# Altium project Reconfigurable_Test_Fixture.PrjPcb
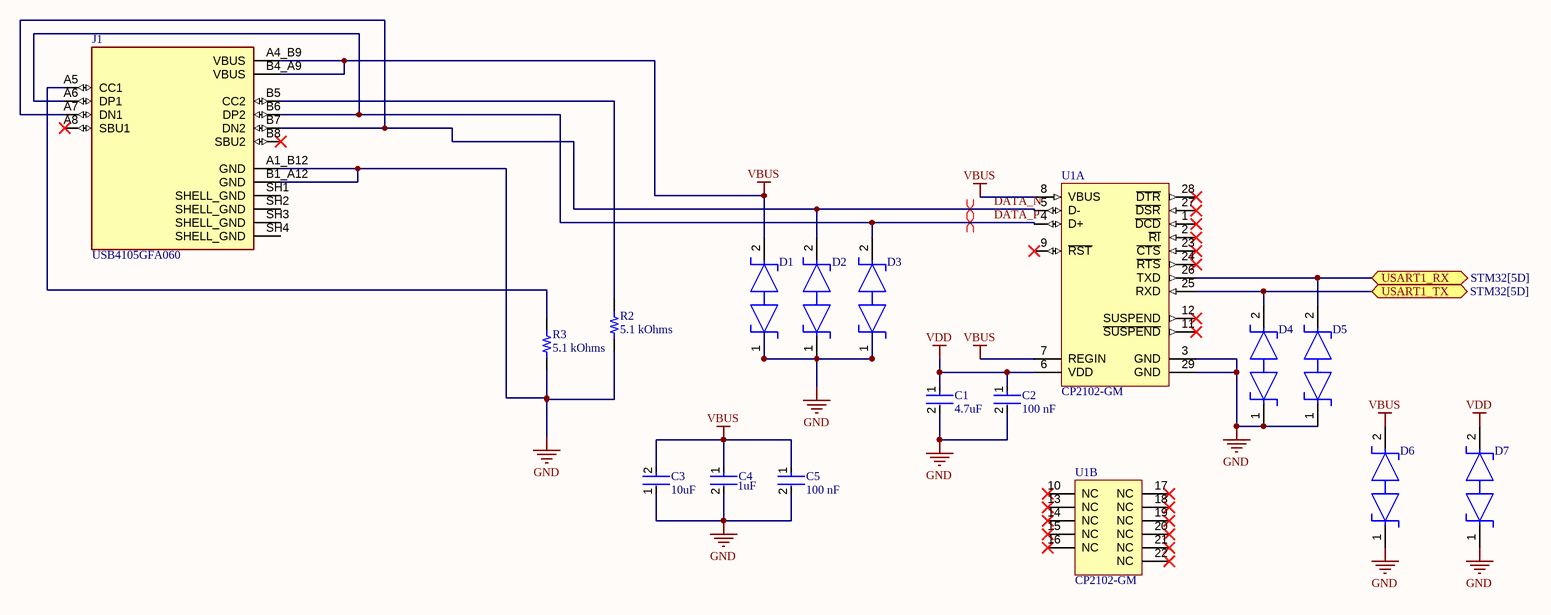
[diagram p0: USB_to_UART.SchDoc]
4 sheets, 80 parts. Net scope: flat (ports and power ports of the same name join across sheets).
Sheets:
  USB_to_UART.SchDoc
  STM32.SchDoc
  Analog_Switch_Array_and_ZIF_ socket.SchDoc
  Muxes_and_ADC.SchDoc

## Sheet USB_to_UART.SchDoc
size 431 x 279 mm; Organization: ORGANIZATION; Address1: ADDRESS 1; Address2: ADDRESS 2; Address3: ADDRESS 3; Address4: ADDRESS 4; Revision: -; SheetNumber: 1; SheetTotal: 4; ENG_APP_DATE: --/--/--; DSN_APP_DATE: --/--/--; CHK_APP_DATE: --/--/--

### Parts
C1  4.7uF  [FP-C1005-050-0_15-IPC_C]
C2  100 nF  [FP-CC0402-MFG]
C3  10uF  [FP-C1608-080-0_1-MFG]
C4  1uF  [FP-C0402C105K8PACTU-MFG]
C5  100 nF  [FP-CC0402-MFG]
D1  TPD1E10B06DPYR  [FP-DPY0002A-MFG]  (value not drawn)
D2  TPD1E10B06DPYR  [FP-DPY0002A-MFG]  (value not drawn)
D3  TPD1E10B06DPYR  [FP-DPY0002A-MFG]  (value not drawn)
D4  TPD1E10B06DPYR  [FP-DPY0002A-MFG]  (value not drawn)
D5  TPD1E10B06DPYR  [FP-DPY0002A-MFG]  (value not drawn)
D6  TPD1E10B06DPYR  [FP-DPY0002A-MFG]  (value not drawn)
D7  TPD1E10B06DPYR  [FP-DPY0002A-MFG]  (value not drawn)
J1  USB4105GFA060  [GCT_USB4105GFA060]
R2  value 5.1 kOhms  [YAGEO RES 0603_1608]  (hidden comment: RC0603JR-105K1L)
R3  value 5.1 kOhms  [YAGEO RES 0603_1608]  (hidden comment: RC0603JR-105K1L)
U1  CP2102-GM  [SLAB-QFN-28-3125x3125TP_N]  (parts A,B of 2)

### Ports
USART1_RX (bidir, see STM32[5D]), USART1_TX (bidir, see STM32[5D])

### Nets
GND: C1.2 C2.2 C3.1 C4.2 C5.2 D1.1 D2.1 D3.1 D4.1 D5.1 D6.1 D7.1 J1.A1_B12(GND) J1.B1_A12(GND) R2.1 R3.1 U1.3(GND) U1.29(GND)
VBUS: C3.2 C4.1 C5.1 D1.2 D6.2 J1.A4_B9(VBUS) J1.B4_A9(VBUS) U1.7(REGIN) U1.8(VBUS)
VDD: C1.1 C2.1 D7.2 U1.6(VDD)
DATA_N: D2.2 J1.A7(DN1) J1.B7(DN2) U1.5(D-)
DATA_P: D3.2 J1.A6(DP1) J1.B6(DP2) U1.4(D+)
NetD4_2: D4.2 U1.25(RXD) ; port USART1_TX
NetD5_2: D5.2 U1.26(TXD) ; port USART1_RX
NetJ1_A5: J1.A5(CC1) R3.2
NetJ1_B5: J1.B5(CC2) R2.2

Not connected (* = marked no-connect by the designer): J1 A8(SBU1)* B8(SBU2)* SH1(SHELL_GND) SH2(SHELL_GND) SH3(SHELL_GND) SH4(SHELL_GND); U1 1(~{DCD})* 2(~{RI})* 9(~{RST})* 10(NC)* 11(~{SUSPEND})* 12(SUSPEND)* 13(NC)* 14(NC)* 15(NC)* 16(NC)* 17(NC)* 18(NC)* 19(NC)* 20(NC)* 21(NC)* 22(NC)* 23(~{CTS})* 24(~{RTS})* 27(~{DSR})* 28(~{DTR})*

### Layout directives
differential pair: DATA_N, DATA_P

### Notes on the sheet
- DWG. NO.
- REV.
- SHT.
- THIS DOCUMENT AND THE DATA DISCLOSED HEREIN OR HEREWITH IS THE PROPERTY OF ALTIUM LIMITED AND MAY BE FREELY DISTRIBUTED IN WHOLE. NO RIGHTS ARE RESERVED OR EXPRESS OR IMPLIED WARANTEE GIVEN.
- REVISION
- DESCRIPTION
- DATE
- APPROVED
- ENG:
- APPROVALS
- PROJECT
- DSN:
- CHK:
- REFERENCE DOCUMENTS
- PROJECT REVISION:
- TITLE
- DOCUMENT REVISION:
- DESIGN ITEM:
- BOM:
- FAB DWG:
- PCB DWG:
- ASSY DWG:
- SCALE:
- SIZE
- B
- CAGE CODE
- FILE NAME
- DWG NO.
- SHEET
- OF
- REV

### Library data of the parts
C1 = CMP-2000-05997-2: CAP CER 4.7UF 10V X5R 0402; Manufacturer: TDK; PartNumber: C1005X5R1A475K050BC; Dielectric Material: Ceramic; Tolerance: 10%; Series: C; Package Quantity: 10000; Max Operating Temperature: 85°C; Case Code (Imperial): 0402; Lead Free: Lead Free; Voltage Rating (DC): 10V; Packaging: Cut Tape; Voltage Rating: 10V; Min Operating Temperature: -55°C; Dielectric: X5R; Thickness: 0.022inch; Width: 0.02inch; Case/Package: 0402; Case Code (Metric): 1005; Capacitance: 4.7uF; Length: 0.039inch; RoHS Compliant: Yes; REACH SVHC: No SVHC; Mount: Surface Mount
C2 C5 = CMP-03422-000048-1: CAP CER 0.1UF 16V X7R 0402; Manufacturer: YAGEO; PartNumber: CC0402KRX7R7BB104; Material: Ceramic; Automotive Grade: NA; Temperature Coefficient: 30ppm/°C; Tolerance: 0.1; Device Class L1: Passive Components; Temperature Range Low: -55°C; Device Class L3: Ceramic Capacitors; Temperature Characteristic: X7R; Ipc Land Pattern Name: CAPC10050X50; Capacitance: 100 nF; Temperature Range High: +125°C; Voltage Rating: 16 V; Temperature: -55°C to +125°C; RoHS: TRUE; Automotive: No; Height: 0.55mm; Device Class L2: Capacitors; Digikey Description: CAP CER 0.1UF 16V X7R 0402; Package: CC0402; Footprint Url: http://www.yageo.com/exep/pages/download/literatures/UPY-C_GEN_24.pdf; ComponentLink2Description: Datasheet; Category: Cap; Lead Free: Yes; Value: 100 nF; Octopart: https://octopart.com/cc0402krx7r7bb104-yageo-42244624; ComponentLink2URL: http://www.yageo.com/documents/recent/UPY-GP_NP0_16V-to-50V_16.pdf; Mouser Description: 0402 0.1 uF 16 V ±10 % Tolerance X7R SMT Multilayer Ceramic Capacitor
C3 = CMP-2000-04979-3: Multilayer Ceramic Capacitors 10μF ±10% 10V X5R SMD 0603; PartNumber: C1608X5R1A106K080AC; Manufacturer: TDK; Dielectric Material: Ceramic; Construction: Flat; Height: 0.8mm; Thickness: 0.035inch; Case Code (Metric): 1608; Radiation Hardening: No; Number of Pins: 2; Voltage Rating (DC): 10V; Depth: 0.8mm; Voltage: 10V; RoHS Compliant: Yes; Voltage Rating: 10V; Package Quantity: 1; Resistor Type: Ceramic; Termination: SMD/SMT; Lead Free: Lead Free; REACH SVHC: No SVHC; Tolerance: 10%; Mount: Surface Mount; Series: C; Packaging: Tape and Reel; Width: 0.8mm; Dielectric: X5R; Weight: 7.1E-05oz; Length: 1.6mm; Max Operating Temperature: 85°C; Case Code (Imperial): 0603; Case/Package: 0603; Min Operating Temperature: -55°C; Capacitance: 10uF
C4 = CMP-2008-02081-2: CAP CER 1UF 10V X5R 0402; Manufacturer: KEMET; PartNumber: C0402C105K8PACTU; Dielectric Material: Ceramic; Dissipation Factor: 5%; Tolerance: 10%; Number of Pins: 2; Contact Plating: Tin; Min Operating Temperature: -55°C; Termination: SMD/SMT; Lead Free: Lead Free; Construction: Flat; Voltage Rating (DC): 10V; Mount: Surface Mount; Series: C; Thickness: 0.022inch; Width: 0.5mm; Radiation Hardening: No; Capacitance: 1uF; Dielectric: X5R; Height: 0.5mm; Voltage: 10V; Length: 1mm; Depth: 0.5mm; Max Operating Temperature: 85°C; Package Quantity: 1; Packaging: Tape and Reel; RoHS Compliant: Yes; Case Code (Imperial): 0402; Case Code (Metric): 1005; REACH SVHC: No SVHC; Voltage Rating: 10V; Case/Package: 0402
D1-D7 = CMP-0326-00004-4: TVS DIODE 5.5V 14V 2X1SON; Manufacturer: Texas Instruments; Leakage Current: 100nA; Min Breakdown Voltage: 6V; Number of Channels: 1; ESD Protection: Yes; Power Line Protection: No; Test Current: 1mA; Interface: GPIO; Element Configuration: Single; Peak Pulse Current: 5A; Direction: Bidirectional; Peak Pulse Power: 90W; Capacitance: 12pF; Composition: Zener; Packaging: Tape and Reel; Number of Pins: 2; Breakdown Voltage: 6V; Radiation Hardening: No; Min Operating Temperature: -40°C; Contact Plating: Gold; Lead Free: Lead Free; Height: 0.35mm; REACH SVHC: No SVHC; Case/Package: 0402; Max Operating Temperature: 125°C; Width: 0.7mm; Clamping Voltage: 14V; Package Quantity: 1; Max Reverse Leakage Current: 100nA; Working Voltage: 5.5V; Length: 1.1mm; Number of Bidirectional Channels: 1; Reverse Standoff Voltage: 5.5V; PartNumber: TPD1E10B06DPYR
J1 = CMP-002-00267-1: USB-C (USB TYPE-C) USB 2.0 Receptacle Connector 24 (16+8 Dummy) Position Surface Mount, Right Angle; Through Hole; MF: Global Connector Technology; Check_prices: https://www.snapeda.com/parts/USB4105GFA060/Global+Connector+Technology/view-part/?ref=eda; Component Type: Standard; Source: USB4105GFA060.SchLib; SnapEDA_Link: https://www.snapeda.com/parts/USB4105GFA060/Global+Connector+Technology/view-part/?ref=snap; Pins: 16; Case/Package: None; Design Item ID: USB4105GFA060; Value: *; MP: USB4105GFA060
R2 R3 = CMP-009-046115-1: RES 5.1K OHM 5% 1/10W 0603; Part Number: RC0603JR-105K1L
U1 = CMP-0511-00012-1: Single-Chip USB to UART Bridge, 1024 Bytes EEPROM, -40 to 85 degC, 28-pin QFN, Tube; Manufacturer: Silicon Labs; Internal Oscillator: TRUE; Sub-Family: USB Bridges; ComponentLink3Description: Package Specification; PackageDescription: 28-Pin Quad-Flat No-Leads Package, Body 5 x 5 mm, Pitch 0.5 mm; PartNumber: CP2102-GM; EEPROM: 1024 Bytes; Mounting Technology: Surface Mount; ComponentLink2URL: http://www.silabs.com/Support%20Documents/TechnicalDocs/CP2102-9.pdf; DatasheetVersion: Rev. 1.5; ComponentLink1URL: http://www.silabs.com/; ComponentLink2Description: Datasheet; Code_JEDEC: MO-220; PackageReference: QFN-28; Code_IPC: J-STD-020C; ComponentLink3URL: http://www.silabs.com/Support%20Documents/TechnicalDocs/C8051T61x.pdf; ComponentLink1Description: Manufacturer URL

## Sheet STM32.SchDoc
size 431 x 279 mm; SheetNumber: 2; SheetTotal: 4
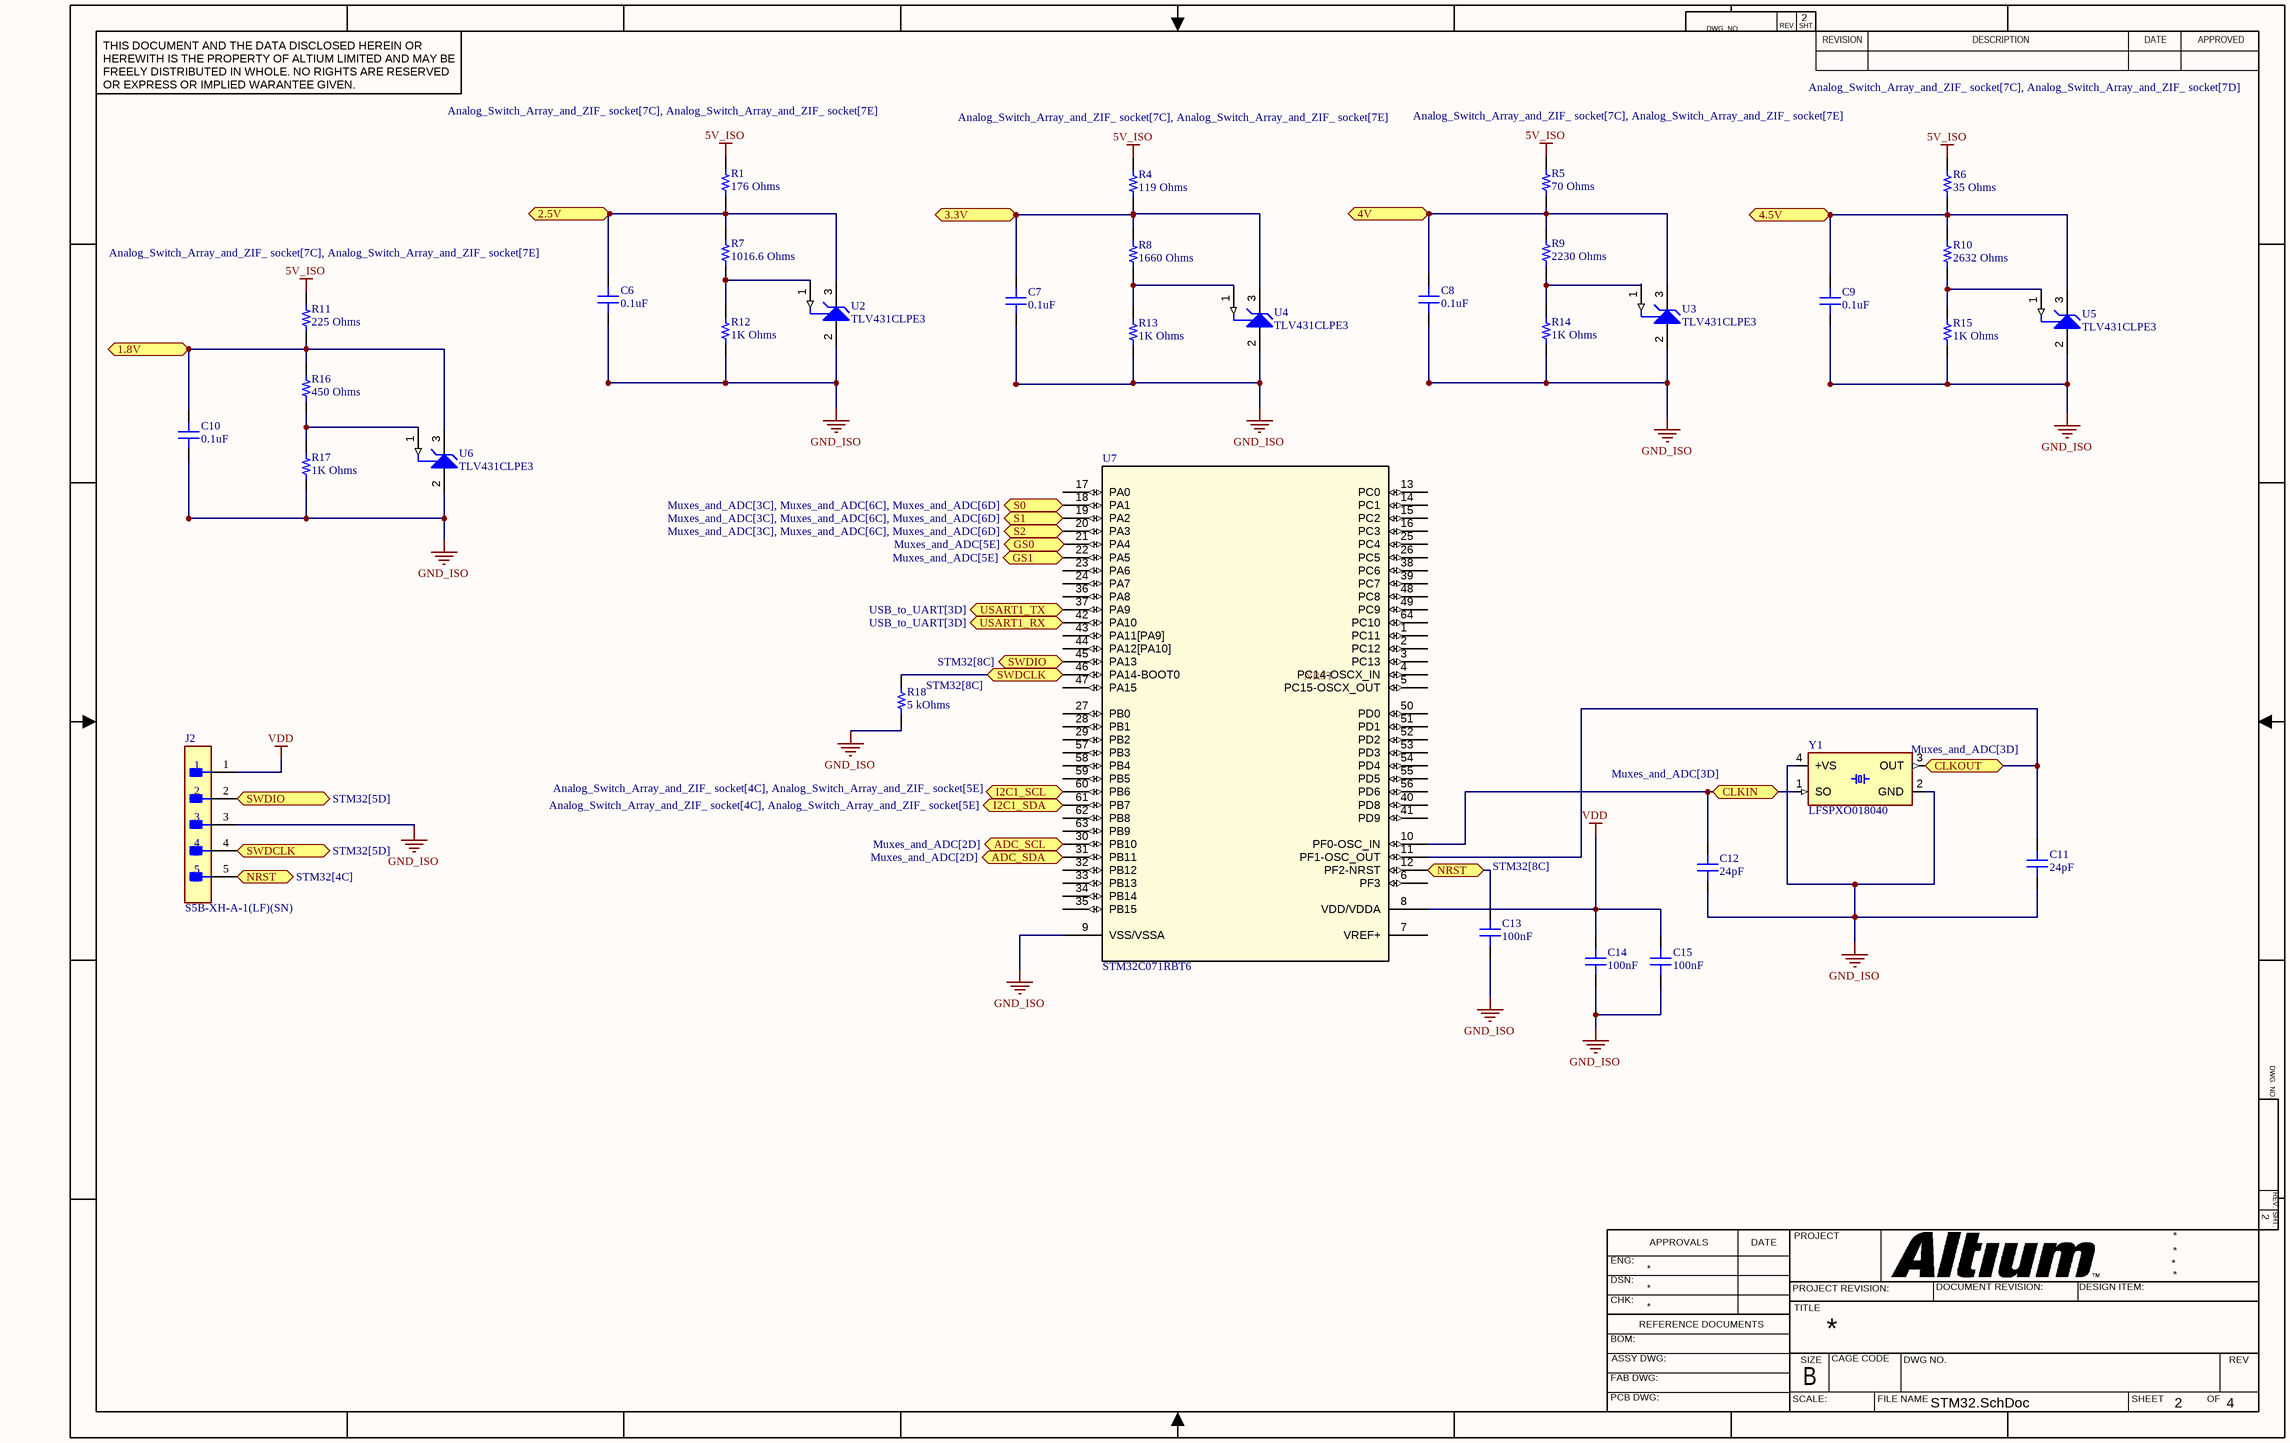
[diagram p1: STM32.SchDoc]

### Parts
C6  value 0.1uF  [MURATA GRM155 0402_1005]  (hidden comment: GRM155R71H104KE14D)
C7  value 0.1uF  [MURATA GRM155 0402_1005]  (hidden comment: GRM155R71H104KE14D)
C8  value 0.1uF  [MURATA GRM155 0402_1005]  (hidden comment: GRM155R71H104KE14D)
C9  value 0.1uF  [MURATA GRM155 0402_1005]  (hidden comment: GRM155R71H104KE14D)
C10  value 0.1uF  [MURATA GRM155 0402_1005]  (hidden comment: GRM155R71H104KE14D)
C11  value 24pF  [MURATA GRM155 0402_1005]  (hidden comment: GRM155R71H104KE14D)
C12  value 24pF  [MURATA GRM155 0402_1005]  (hidden comment: GRM155R71H104KE14D)
C13  value 100nF  [MURATA GRM155 0402_1005]  (hidden comment: GRM155R71H104KE14D)
C14  value 100nF  [MURATA GRM155 0402_1005]  (hidden comment: GRM155R71H104KE14D)
C15  value 100nF  [MURATA GRM155 0402_1005]  (hidden comment: GRM155R71H104KE14D)
J2  S5B-XH-A-1(LF)(SN)  [FP-S5B-XH-A-1_LF_SN-MFG]
R1  value 176 Ohms  [RES 0805_2012]  (hidden comment: RMEF0805FT200R)
R4  value 119 Ohms  [RES 0805_2012]  (hidden comment: RMEF0805FT200R)
R5  value 70 Ohms  [RES 0805_2012]  (hidden comment: RMEF0805FT200R)
R6  value 35 Ohms  [RES 0805_2012]  (hidden comment: RMEF0805FT200R)
R7  value 1016.6 Ohms  [RES 0805_2012]  (hidden comment: RMEF0805FT200R)
R8  value 1660 Ohms  [RES 0805_2012]  (hidden comment: RMEF0805FT200R)
R9  value 2230 Ohms  [RES 0805_2012]  (hidden comment: RMEF0805FT200R)
R10  value 2632 Ohms  [RES 0805_2012]  (hidden comment: RMEF0805FT200R)
R11  value 225 Ohms  [RES 0805_2012]  (hidden comment: RMEF0805FT200R)
R12  value 1K Ohms  [RES 0805_2012]  (hidden comment: RMEF0805FT200R)
R13  value 1K Ohms  [RES 0805_2012]  (hidden comment: RMEF0805FT200R)
R14  value 1K Ohms  [RES 0805_2012]  (hidden comment: RMEF0805FT200R)
R15  value 1K Ohms  [RES 0805_2012]  (hidden comment: RMEF0805FT200R)
R16  value 450 Ohms  [RES 0805_2012]  (hidden comment: RMEF0805FT200R)
R17  value 1K Ohms  [RES 0805_2012]  (hidden comment: RMEF0805FT200R)
R18  value 5 kOhms  [RES 0603_1608]  (hidden comment: PNM0603E5001BST5)
U2  TLV431CLPE3  [TI-LP3]
U3  TLV431CLPE3  [TI-LP3]
U4  TLV431CLPE3  [TI-LP3]
U5  TLV431CLPE3  [TI-LP3]
U6  TLV431CLPE3  [TI-LP3]
U7  STM32C071RBT6  [LQFP-64_STM]
Y1  LFSPXO018040  [WE-SPXO_LFSPXO018040]

### Ports
1.8V (bidir, see Analog_Switch_Array_and_ZIF_ socket[7C], Analog_Switch_Array_and_ZIF_ socket[7E]), 2.5V (bidir, see Analog_Switch_Array_and_ZIF_ socket[7C], Analog_Switch_Array_and_ZIF_ socket[7E]), 3.3V (bidir, see Analog_Switch_Array_and_ZIF_ socket[7C], Analog_Switch_Array_and_ZIF_ socket[7E]), 4.5V (bidir, see Analog_Switch_Array_and_ZIF_ socket[7C], Analog_Switch_Array_and_ZIF_ socket[7D]), 4V (bidir, see Analog_Switch_Array_and_ZIF_ socket[7C], Analog_Switch_Array_and_ZIF_ socket[7E]), ADC_SCL (bidir, see Muxes_and_ADC[2D]), ADC_SDA (bidir, see Muxes_and_ADC[2D]), CLKIN (bidir, see Muxes_and_ADC[3D]), CLKOUT (bidir, see Muxes_and_ADC[3D]), GS0 (bidir, see Muxes_and_ADC[5E]), GS1 (bidir, see Muxes_and_ADC[5E]), I2C1_SCL (bidir, see Analog_Switch_Array_and_ZIF_ socket[4C], Analog_Switch_Array_and_ZIF_ socket[5E]), I2C1_SDA (bidir, see Analog_Switch_Array_and_ZIF_ socket[4C], Analog_Switch_Array_and_ZIF_ socket[5E]), NRST (bidir, see STM32[4C]), NRST (bidir, see STM32[8C]), S0 (bidir, see Muxes_and_ADC[3C], Muxes_and_ADC[6C], Muxes_and_ADC[6D]), S1 (bidir, see Muxes_and_ADC[3C], Muxes_and_ADC[6C], Muxes_and_ADC[6D]), S2 (bidir, see Muxes_and_ADC[3C], Muxes_and_ADC[6C], Muxes_and_ADC[6D]), SWDCLK (bidir, see STM32[5D]), SWDCLK (bidir, see STM32[8C]), SWDIO (bidir, see STM32[5D]), SWDIO (bidir, see STM32[8C]), USART1_RX (bidir, see USB_to_UART[3D]), USART1_TX (bidir, see USB_to_UART[3D])

### Nets
5V_ISO: R1.1 R4.1 R5.1 R6.1 R11.1
GND_ISO: C6.1 C7.1 C8.1 C9.1 C10.1 C11.1 C12.1 C13.1 C14.1 C15.1 J2.3 R12.1 R13.1 R14.1 R15.1 R17.1 R18.1 U2.2(ANODE) U3.2(ANODE) U4.2(ANODE) U5.2(ANODE) U6.2(ANODE) U7.9(VSS/VSSA) Y1.2(GND) Y1.4(+VS)
VDD: C14.2 C15.2 J2.1 U7.8(VDD/VDDA)
NetC6_2: C6.2 R1.2 R7.2 U2.3(CATHODE) ; port 2.5V
NetC7_2: C7.2 R4.2 R8.2 U4.3(CATHODE) ; port 3.3V
NetC8_2: C8.2 R5.2 R9.2 U3.3(CATHODE) ; port 4V
NetC9_2: C9.2 R6.2 R10.2 U5.3(CATHODE) ; port 4.5V
NetC10_2: C10.2 R11.2 R16.2 U6.3(CATHODE) ; port 1.8V
NetC11_2: C11.2 U7.11(PF1-OSC_OUT) Y1.3(OUT) ; port CLKOUT
NetC12_2: C12.2 U7.10(PF0-OSC_IN) Y1.1(SO) ; port CLKIN
NetC13_2: C13.2 J2.5 U7.12(PF2-NRST) ; port NRST
NetD4_2: U7.37(PA9) ; port USART1_TX
NetD5_2: U7.42(PA10) ; port USART1_RX
NetJ2_2: J2.2 U7.45(PA13) ; port SWDIO
NetJ2_4: J2.4 R18.2 U7.46(PA14-BOOT0) ; port SWDCLK
NetR7_1: R7.1 R12.2 U2.1(REF)
NetR8_1: R8.1 R13.2 U4.1(REF)
NetR9_1: R9.1 R14.2 U3.1(REF)
NetR10_1: R10.1 R15.2 U5.1(REF)
NetR16_1: R16.1 R17.2 U6.1(REF)
NetR20_1: U7.60(PB6) ; port I2C1_SCL
NetR20_2: U7.61(PB7) ; port I2C1_SDA
NetR25_2: U7.30(PB10) ; port ADC_SCL
NetR26_2: U7.31(PB11) ; port ADC_SDA
NetU7_18: U7.18(PA1) ; port S0
NetU7_19: U7.19(PA2) ; port S1
NetU7_20: U7.20(PA3) ; port S2
NetU7_22: U7.22(PA5) ; port GS1

Not connected (* = marked no-connect by the designer): U7 1(PC11) 2(PC12) 3(PC13) 4(PC14-OSCX_IN) 5(PC15-OSCX_OUT) 6(PF3) 7(VREF+) 13(PC0) 14(PC1) 15(PC2) 16(PC3) 17(PA0) 21(PA4) 23(PA6) 24(PA7) 25(PC4) 26(PC5) 27(PB0) 28(PB1) 29(PB2) 32(PB12) 33(PB13) 34(PB14) 35(PB15) 36(PA8) 38(PC6) 39(PC7) 40(PD8) 41(PD9) 43(PA11[PA9]) 44(PA12[PA10]) 47(PA15) 48(PC8) 49(PC9) 50(PD0) 51(PD1) 52(PD2) 53(PD3) 54(PD4) 55(PD5) 56(PD6) 57(PB3) 58(PB4) 59(PB5) 62(PB8) 63(PB9) 64(PC10)

### Notes on the sheet
- Labels drawn without touching a wire or pin: NRST
- DWG. NO.
- REV.
- SHT.
- THIS DOCUMENT AND THE DATA DISCLOSED HEREIN OR HEREWITH IS THE PROPERTY OF ALTIUM LIMITED AND MAY BE FREELY DISTRIBUTED IN WHOLE. NO RIGHTS ARE RESERVED OR EXPRESS OR IMPLIED WARANTEE GIVEN.
- REVISION
- DESCRIPTION
- DATE
- APPROVED
- ENG:
- APPROVALS
- PROJECT
- DSN:
- CHK:
- REFERENCE DOCUMENTS
- PROJECT REVISION:
- TITLE
- DOCUMENT REVISION:
- DESIGN ITEM:
- BOM:
- FAB DWG:
- PCB DWG:
- ASSY DWG:
- SCALE:
- SIZE
- B
- CAGE CODE
- FILE NAME
- DWG NO.
- SHEET
- OF
- REV

### Library data of the parts
C6-C15 = CMP-001-031367-1: CAP CER 0.1UF 50V X7R 0402; Part Number: GRM155R71H104KE14D
J2 = CMP-17439-000362-1: CONN HEADER R/A 5POS 2.5MM; Number of Positions: 5; Voltage Rating: 250V; Contact Shape: Square; Number of Rows: 1; Lead Free: Lead Free; Contact Material: Brass; Termination: Press-Fit; Connector Type: Header; Contact Finish - Mating: TIN; Insulation Color: Natural; Packaging: Bulk; Min Operating Temperature: -25°C; Series: XH; Mount: Through Hole; Contact Type: Male Pin; Insulation Material: Nylon; Max Operating Temperature: 85°C; Pitch: 2.5mm; Fastening Type: Detent; Flammability Rating: UL94 V-0
R1 R4-R17 = CMP-009-068802-1: RES 200 OHM 1% 1/8W 0805; Part Number: RMEF0805FT200R
R18 = CMP-009-033475-1: RES SMD 5K OHM 0.1% 0.15W 0603; Part Number: PNM0603E5001BST5
U2-U6 = CMP-0366-00210-1: Low Voltage Adjustable Precision Shunt Regulator, 39 ppm / degC, 15 mA, 0 to 70 degC, 3-pin TO-92 (LP), Pb-Free (RoHS); Manufacturer: Texas Instruments; Eco-Plan: Green (RoHS & no Sb/Br); Iout/Iz(Max)(mA): 15; VO Adj(Max)(V): 6; Min Iz for Regulation(uA): 80; SubFamily: Shunt Voltage Reference; VO Adj(Min)(V): 1.24; Rating: Catalog; Temp Coeff(Typ)(ppm/ degree C): 39; Initial Accuracy @ 25/deg C(%): 1.5; Temp Coeff(Max)(ppm/ degree C): 129; PackageReference: LP3; PackageDescription: Plastic Cylindrical Package, Formed Lead Option (TO-92); ComponentLink2URL: http://www.ti.com/general/docs/lit/getliterature.tsp?genericPartNumber=TLV431&fileType=pdf; ComponentLink2Description: Datasheet; ComponentLink3Description: Package Specification; ComponentLink1URL: http://www.ti.com/; PartNumber: TLV431CLPE3; PackageVersion: 4040001-2/C; Code_JEDEC: TO-226; ComponentLink3URL: http://www.ti.com/litv/pdf/msot002a; DatasheetVersion: SLVS139T; ComponentLink1Description: Manufacturer URL; Mounting Technology: Through Hole
U7 = CMP-031-00033-1: Mainstream Arm Cortex-M0+ MCU with 128 Kbytes of Flash memory, 24 Kbytes RAM, 48 MHz CPU, 2x USART, timers, ADC, comm. I/F, USB FS, 2-3.6V; Manufacturer_Name: STMicroelectronics; Copyright: Copyright (C) 2025 Ultra Librarian. All rights reserved.; Component Type: Standard; Pins: 64; Source: STM32C071RBT6.SchLib; Type: Type; RefDes: RefDes; Manufacturer_Part_Number: STM32C071RBT6; Design Item ID: STM32C071RBT6
Y1 = CMP-574-000000-1: MF: IQD Frequency Products; MP: LFSPXO018040; Availability: Available; Component Type: Standard; Pin Count: 4; Package: 4-SMD, No Lead; Source: LFSPXO018040.SchLib; Design Item ID: LFSPXO018040; Value: *; Price: $1.72

## Sheet Analog_Switch_Array_and_ZIF_ socket.SchDoc
size 431 x 279 mm; Organization: ORGANIZATION; Address1: ADDRESS 1; Address2: ADDRESS 2; Address3: ADDRESS 3; Address4: ADDRESS 4; Revision: -; SheetNumber: 3; SheetTotal: 4; ENG_APP_DATE: --/--/--; DSN_APP_DATE: --/--/--; CHK_APP_DATE: --/--/--
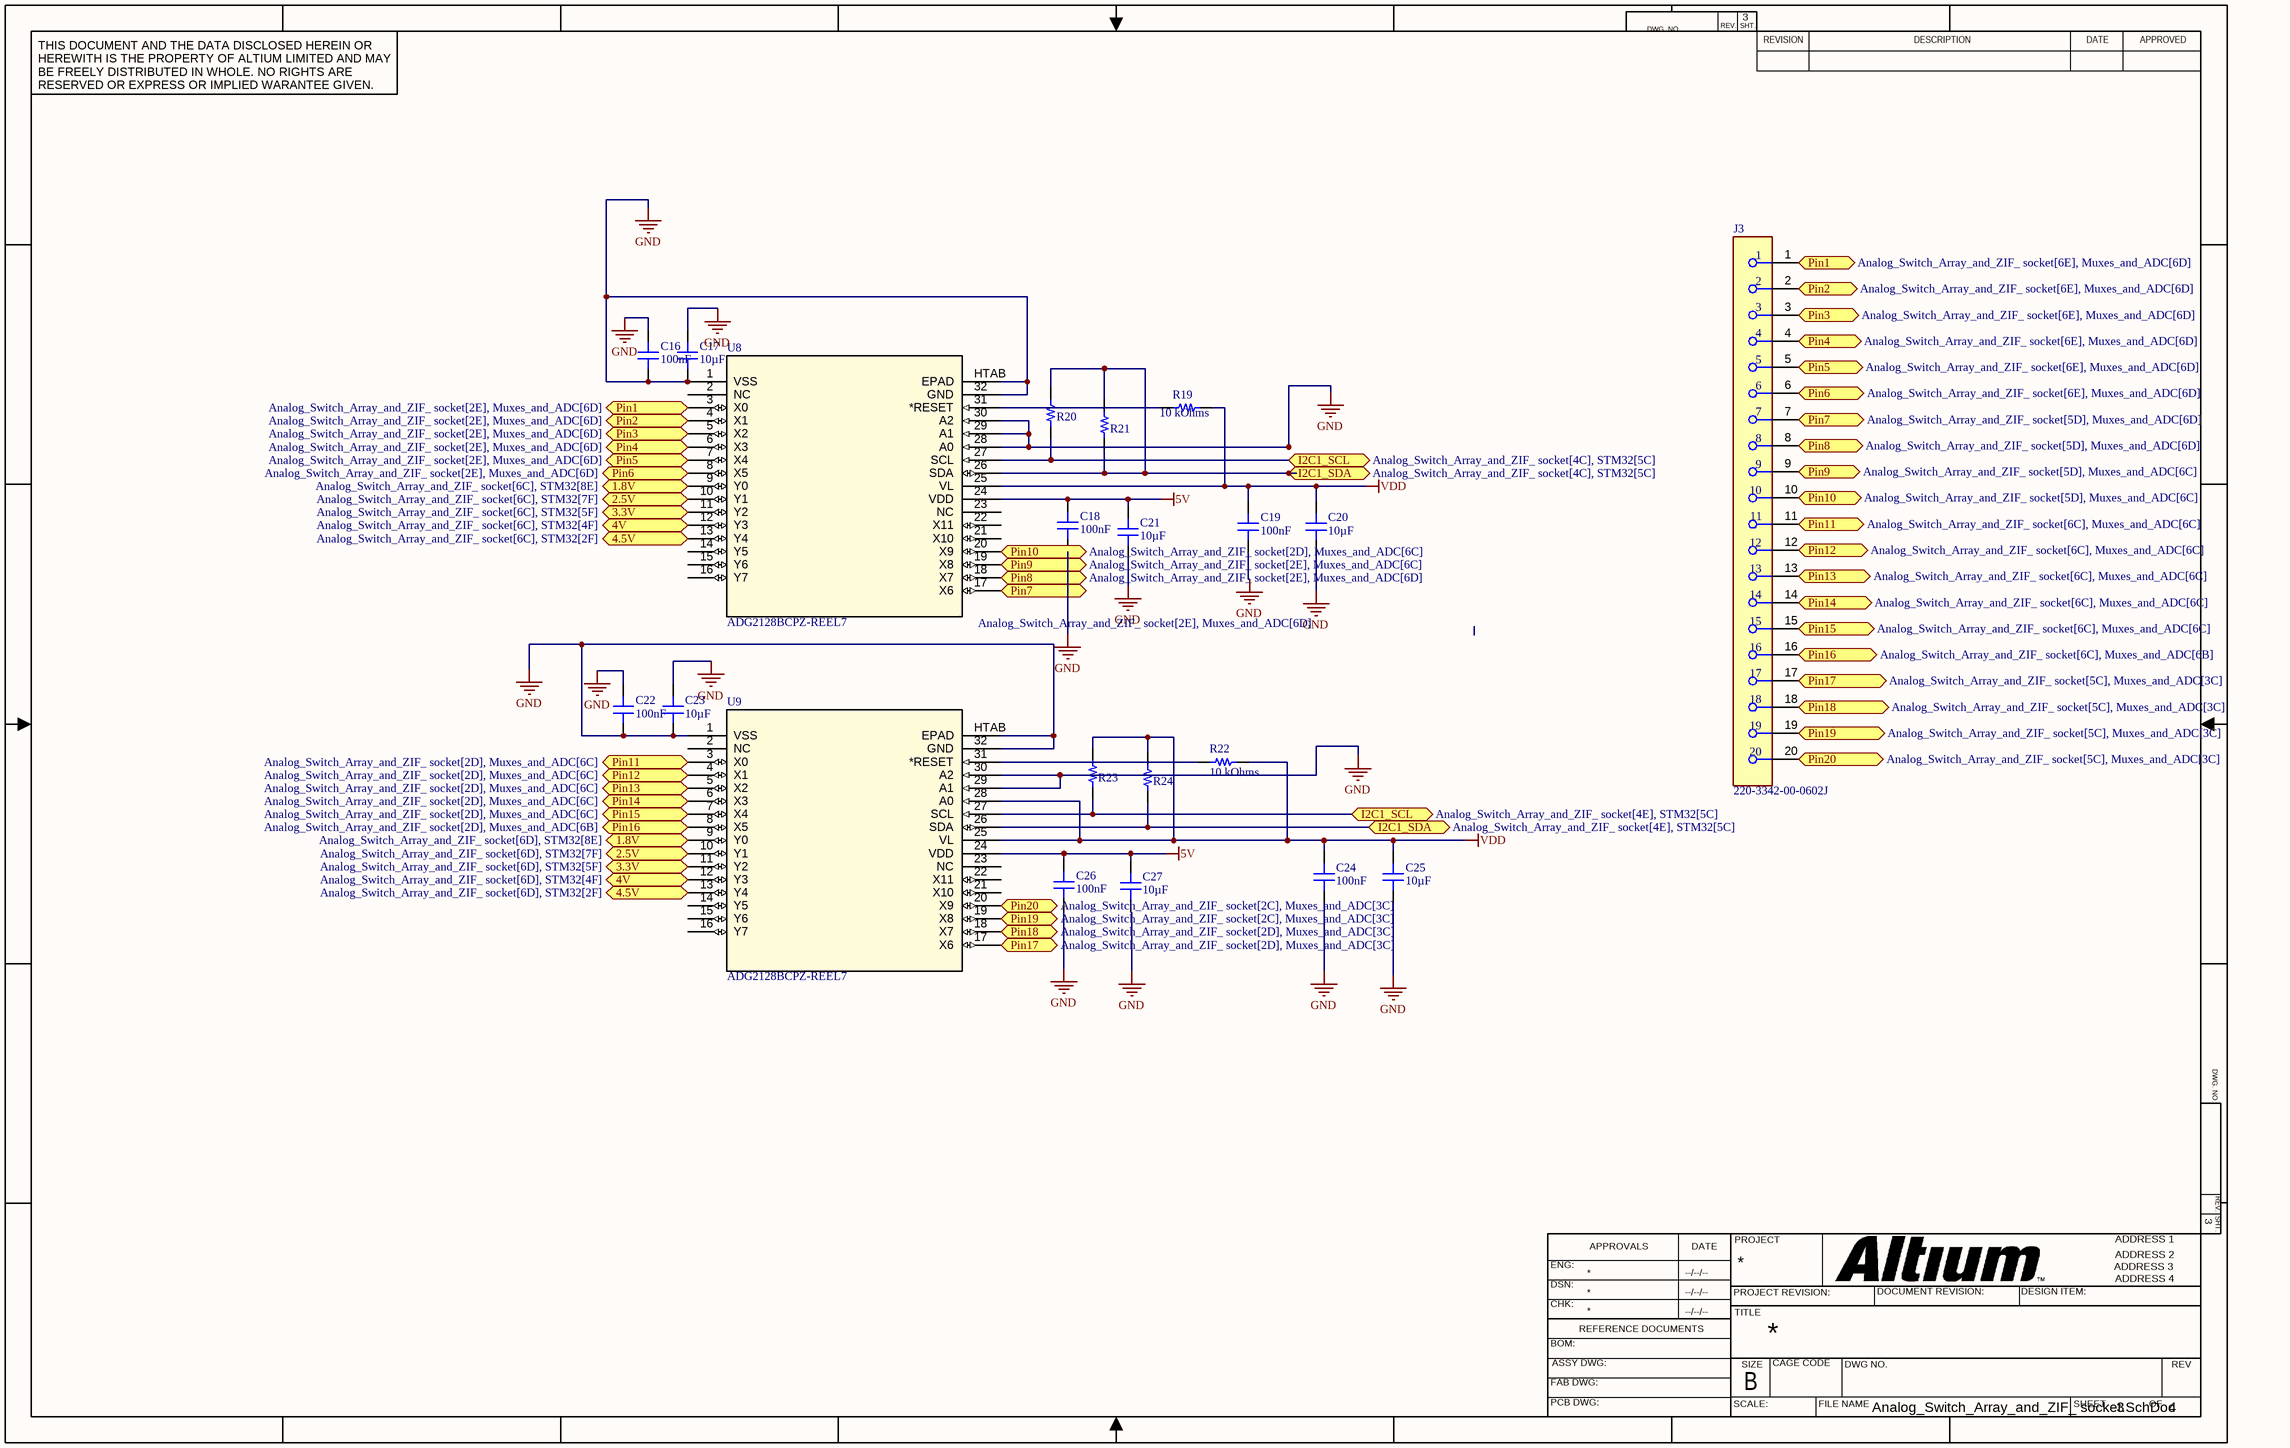
[diagram p2: Analog_Switch_Array_and_ZIF_ socket.SchDoc]

### Parts
C16  value 100nF  [CAP 1206_3216 - 0.8MM]  (hidden comment: C1206X104G4HAC7800)
C17  value 10µF  [CAP 0603_1608]  (hidden comment: KGM15CR51A106MM)
C18  value 100nF  [CAP 1206_3216 - 0.8MM]  (hidden comment: C1206X104G4HAC7800)
C19  value 100nF  [CAP 1206_3216 - 0.8MM]  (hidden comment: C1206X104G4HAC7800)
C20  value 10µF  [CAP 0603_1608]  (hidden comment: KGM15CR51A106MM)
C21  value 10µF  [CAP 0603_1608]  (hidden comment: KGM15CR51A106MM)
C22  value 100nF  [CAP 1206_3216 - 0.8MM]  (hidden comment: C1206X104G4HAC7800)
C23  value 10µF  [CAP 0603_1608]  (hidden comment: KGM15CR51A106MM)
C24  value 100nF  [CAP 1206_3216 - 0.8MM]  (hidden comment: C1206X104G4HAC7800)
C25  value 10µF  [CAP 0603_1608]  (hidden comment: KGM15CR51A106MM)
C26  value 100nF  [CAP 1206_3216 - 0.8MM]  (hidden comment: C1206X104G4HAC7800)
C27  value 10µF  [CAP 0603_1608]  (hidden comment: KGM15CR51A106MM)
J3  220-3342-00-0602J  [FP-220-3342-00-0602J-0]
R19  value 10 kOhms  [RES 0402_1005]  (hidden comment: RP73PF1E10KBTDF)
R20  SG732ETTD222K  [RES 1210_3225]  (value not drawn)
R21  SG732ETTD222K  [RES 1210_3225]  (value not drawn)
R22  value 10 kOhms  [RES 0402_1005]  (hidden comment: RP73PF1E10KBTDF)
R23  SG732ETTD222K  [RES 1210_3225]  (value not drawn)
R24  SG732ETTD222K  [RES 1210_3225]  (value not drawn)
U8  ADG2128BCPZ-REEL7  [CP_32_7_ADI]
U9  ADG2128BCPZ-REEL7  [CP_32_7_ADI]

### Ports
1.8V (bidir, see Analog_Switch_Array_and_ZIF_ socket[6C], STM32[8E]), 1.8V (bidir, see Analog_Switch_Array_and_ZIF_ socket[6D], STM32[8E]), 2.5V (bidir, see Analog_Switch_Array_and_ZIF_ socket[6C], STM32[7F]), 2.5V (bidir, see Analog_Switch_Array_and_ZIF_ socket[6D], STM32[7F]), 3.3V (bidir, see Analog_Switch_Array_and_ZIF_ socket[6C], STM32[5F]), 3.3V (bidir, see Analog_Switch_Array_and_ZIF_ socket[6D], STM32[5F]), 4.5V (bidir, see Analog_Switch_Array_and_ZIF_ socket[6C], STM32[2F]), 4.5V (bidir, see Analog_Switch_Array_and_ZIF_ socket[6D], STM32[2F]), 4V (bidir, see Analog_Switch_Array_and_ZIF_ socket[6C], STM32[4F]), 4V (bidir, see Analog_Switch_Array_and_ZIF_ socket[6D], STM32[4F]), I2C1_SCL (bidir, see Analog_Switch_Array_and_ZIF_ socket[4C], STM32[5C]), I2C1_SCL (bidir, see Analog_Switch_Array_and_ZIF_ socket[4E], STM32[5C]), I2C1_SDA (bidir, see Analog_Switch_Array_and_ZIF_ socket[4C], STM32[5C]), I2C1_SDA (bidir, see Analog_Switch_Array_and_ZIF_ socket[4E], STM32[5C]), Pin1 (bidir, see Analog_Switch_Array_and_ZIF_ socket[2E], Muxes_and_ADC[6D]), Pin1 (bidir, see Analog_Switch_Array_and_ZIF_ socket[6E], Muxes_and_ADC[6D]), Pin2 (bidir, see Analog_Switch_Array_and_ZIF_ socket[2E], Muxes_and_ADC[6D]), Pin2 (bidir, see Analog_Switch_Array_and_ZIF_ socket[6E], Muxes_and_ADC[6D]), Pin3 (bidir, see Analog_Switch_Array_and_ZIF_ socket[2E], Muxes_and_ADC[6D]), Pin3 (bidir, see Analog_Switch_Array_and_ZIF_ socket[6E], Muxes_and_ADC[6D]), Pin4 (bidir, see Analog_Switch_Array_and_ZIF_ socket[2E], Muxes_and_ADC[6D]), Pin4 (bidir, see Analog_Switch_Array_and_ZIF_ socket[6E], Muxes_and_ADC[6D]), Pin5 (bidir, see Analog_Switch_Array_and_ZIF_ socket[2E], Muxes_and_ADC[6D]), Pin5 (bidir, see Analog_Switch_Array_and_ZIF_ socket[6E], Muxes_and_ADC[6D]), Pin6 (bidir, see Analog_Switch_Array_and_ZIF_ socket[2E], Muxes_and_ADC[6D]), Pin6 (bidir, see Analog_Switch_Array_and_ZIF_ socket[6E], Muxes_and_ADC[6D]), Pin7 (bidir, see Analog_Switch_Array_and_ZIF_ socket[2E], Muxes_and_ADC[6D]), Pin7 (bidir, see Analog_Switch_Array_and_ZIF_ socket[5D], Muxes_and_ADC[6D]), Pin8 (bidir, see Analog_Switch_Array_and_ZIF_ socket[2E], Muxes_and_ADC[6D]), Pin8 (bidir, see Analog_Switch_Array_and_ZIF_ socket[5D], Muxes_and_ADC[6D]), Pin9 (bidir, see Analog_Switch_Array_and_ZIF_ socket[2E], Muxes_and_ADC[6C]), Pin9 (bidir, see Analog_Switch_Array_and_ZIF_ socket[5D], Muxes_and_ADC[6C]), Pin10 (bidir, see Analog_Switch_Array_and_ZIF_ socket[2D], Muxes_and_ADC[6C]), Pin10 (bidir, see Analog_Switch_Array_and_ZIF_ socket[5D], Muxes_and_ADC[6C]), Pin11 (bidir, see Analog_Switch_Array_and_ZIF_ socket[2D], Muxes_and_ADC[6C]), Pin11 (bidir, see Analog_Switch_Array_and_ZIF_ socket[6C], Muxes_and_ADC[6C]), Pin12 (bidir, see Analog_Switch_Array_and_ZIF_ socket[2D], Muxes_and_ADC[6C]), Pin12 (bidir, see Analog_Switch_Array_and_ZIF_ socket[6C], Muxes_and_ADC[6C]), Pin13 (bidir, see Analog_Switch_Array_and_ZIF_ socket[2D], Muxes_and_ADC[6C]), Pin13 (bidir, see Analog_Switch_Array_and_ZIF_ socket[6C], Muxes_and_ADC[6C]), Pin14 (bidir, see Analog_Switch_Array_and_ZIF_ socket[2D], Muxes_and_ADC[6C]), Pin14 (bidir, see Analog_Switch_Array_and_ZIF_ socket[6C], Muxes_and_ADC[6C]), Pin15 (bidir, see Analog_Switch_Array_and_ZIF_ socket[2D], Muxes_and_ADC[6C]), Pin15 (bidir, see Analog_Switch_Array_and_ZIF_ socket[6C], Muxes_and_ADC[6C]), Pin16 (bidir, see Analog_Switch_Array_and_ZIF_ socket[2D], Muxes_and_ADC[6B]), Pin16 (bidir, see Analog_Switch_Array_and_ZIF_ socket[6C], Muxes_and_ADC[6B]), Pin17 (bidir, see Analog_Switch_Array_and_ZIF_ socket[2D], Muxes_and_ADC[3C]), Pin17 (bidir, see Analog_Switch_Array_and_ZIF_ socket[5C], Muxes_and_ADC[3C]), Pin18 (bidir, see Analog_Switch_Array_and_ZIF_ socket[2D], Muxes_and_ADC[3C]), Pin18 (bidir, see Analog_Switch_Array_and_ZIF_ socket[5C], Muxes_and_ADC[3C]), Pin19 (bidir, see Analog_Switch_Array_and_ZIF_ socket[2C], Muxes_and_ADC[3C]), Pin19 (bidir, see Analog_Switch_Array_and_ZIF_ socket[5C], Muxes_and_ADC[3C]), Pin20 (bidir, see Analog_Switch_Array_and_ZIF_ socket[2C], Muxes_and_ADC[3C]), Pin20 (bidir, see Analog_Switch_Array_and_ZIF_ socket[5C], Muxes_and_ADC[3C])

### Nets
5V: C18.2 C21.2 C26.2 C27.2 U8.24(VDD) U9.24(VDD)
GND: C16.1 C16.2 C17.1 C17.2 C18.1 C19.1 C20.1 C21.1 C22.1 C22.2 C23.1 C23.2 C24.1 C25.1 C26.1 C27.1 U8.1(VSS) U8.28(A0) U8.29(A1) U8.30(A2) U8.32(GND) U8.HTAB(EPAD) U9.1(VSS) U9.29(A1) U9.30(A2) U9.32(GND) U9.HTAB(EPAD)
VDD: C19.2 C20.2 C24.2 C25.2 R19.2 R22.2 R23.2 R24.2 U8.25(VL) U9.25(VL) U9.28(A0)
NetC6_2: U8.10(Y1) U9.10(Y1) ; port 2.5V
NetC7_2: U8.11(Y2) U9.11(Y2) ; port 3.3V
NetC8_2: U8.12(Y3) U9.12(Y3) ; port 4V
NetC9_2: U8.13(Y4) U9.13(Y4) ; port 4.5V
NetC10_2: U8.9(Y0) U9.9(Y0) ; port 1.8V
NetJ3_1: J3.1 U8.3(X0) ; port Pin1
NetJ3_2: J3.2 U8.4(X1) ; port Pin2
NetJ3_3: J3.3 U8.5(X2) ; port Pin3
NetJ3_4: J3.4 U8.6(X3) ; port Pin4
NetJ3_5: J3.5 U8.7(X4) ; port Pin5
NetJ3_6: J3.6 U8.8(X5) ; port Pin6
NetJ3_7: J3.7 U8.17(X6) ; port Pin7
NetJ3_8: J3.8 U8.18(X7) ; port Pin8
NetJ3_9: J3.9 U8.19(X8) ; port Pin9
NetJ3_10: J3.10 U8.20(X9) ; port Pin10
NetJ3_11: J3.11 U9.3(X0) ; port Pin11
NetJ3_12: J3.12 U9.4(X1) ; port Pin12
NetJ3_13: J3.13 U9.5(X2) ; port Pin13
NetJ3_14: J3.14 U9.6(X3) ; port Pin14
NetJ3_15: J3.15 U9.7(X4) ; port Pin15
NetJ3_16: J3.16 U9.8(X5) ; port Pin16
NetJ3_17: J3.17 U9.17(X6) ; port Pin17
NetJ3_18: J3.18 U9.18(X7) ; port Pin18
NetJ3_19: J3.19 U9.19(X8) ; port Pin19
NetJ3_20: J3.20 U9.20(X9) ; port Pin20
NetR19_1: R19.1 U8.31(*RESET)
NetR20_1: R20.1 R23.1 U8.27(SCL) U9.27(SCL) ; port I2C1_SCL
NetR20_2: R20.2 R21.1 R21.2 R24.1 U8.26(SDA) U9.26(SDA) ; port I2C1_SDA
NetR22_1: R22.1 U9.31(*RESET)

Not connected (* = marked no-connect by the designer): U8 2(NC) 14(Y5) 15(Y6) 16(Y7) 21(X10) 22(X11) 23(NC); U9 2(NC) 14(Y5) 15(Y6) 16(Y7) 21(X10) 22(X11) 23(NC)

### Notes on the sheet
- DWG. NO.
- REV.
- SHT.
- THIS DOCUMENT AND THE DATA DISCLOSED HEREIN OR HEREWITH IS THE PROPERTY OF ALTIUM LIMITED AND MAY BE FREELY DISTRIBUTED IN WHOLE. NO RIGHTS ARE RESERVED OR EXPRESS OR IMPLIED WARANTEE GIVEN.
- REVISION
- DESCRIPTION
- DATE
- APPROVED
- ENG:
- APPROVALS
- PROJECT
- DSN:
- CHK:
- REFERENCE DOCUMENTS
- PROJECT REVISION:
- TITLE
- DOCUMENT REVISION:
- DESIGN ITEM:
- BOM:
- FAB DWG:
- PCB DWG:
- ASSY DWG:
- SCALE:
- SIZE
- B
- CAGE CODE
- FILE NAME
- DWG NO.
- SHEET
- OF
- REV

### Library data of the parts
C16 C18 C19 C22 C24 C26 = CMP-001-063573-1: CAP CER 1206 0.1F 16V ULTRA STAB; Part Number: C1206X104G4HAC7800
C17 C20 C21 C23 C25 C27 = CMP-001-046966-1: CAP CER 10UF 10V X5R 0603; Part Number: KGM15CR51A106MM
J3 = CMP-05380-000001-1: CONN IC DIP SOCKET ZIF 20POS GLD; Manufacturer: 3M; Is Female: yes; Standoff Height: 0.38mm; Conn Orientation: Vertical; Number Of Contacts: 20; Conn Gender: Female; Socket Package: DIP20; Pitch: 2.54mm; Current Rating: 1A; Category: Conn; Temperature Range Low: -55°C; Package: 0; Device Class L3: unset; Temperature: -55°C to +125°C; Number Of Rows: 2; ComponentLink2Description: Datasheet; ComponentLink2URL: https://multimedia.3m.com/mws/media/494546O/3mtm-dip-sockets-100-2-54-mm-ts0365.pdf; Temperature Range High: +125°C; Digikey Description: CONN IC DIP SOCKET ZIF 20POS GLD; Mouser Description: IC & Component Sockets 0.100 DIP SOCKET 20 Contact Qty.; Manufacturer Part Number: 220-3342-00-0602J; Device Class L2: IC and Component Sockets; Octopart: https://octopart.com/220-3342-00-0602j-3m-108647; Device Class L1: Connectors; Contact Material: Gold,Nickel; Height: 24mm; Lead Free: Yes; RoHS: TRUE; Automotive: No
R19 R22 = CMP-009-026965-1: RES 10K OHM 0.1% 1/16W 0402; Part Number: RP73PF1E10KBTDF
R20 R21 R23 R24 = CMP-009-093445-1: RES 2.2K OHM 10% 1/2W 1210; Part Number: SG732ETTD222K
U8 U9 = CMP-011-00018-1: I2C CMOS 8 X 12 Analog Switch Array with Dual/Single Supplies; Manufacturer_Name: Analog Devices Inc; Manufacturer_Part_Number: ADG2128BCPZ-REEL7; Component Type: Standard; Source: ADG2128BCPZ-REEL7.SchLib; Type: Type; Pins: 33; RefDes: RefDes; Copyright: Copyright (C) 2025 Ultra Librarian. All rights reserved.; Design Item ID: ADG2128BCPZ-REEL7

## Sheet Muxes_and_ADC.SchDoc
size 431 x 279 mm; Organization: ORGANIZATION; Address1: ADDRESS 1; Address2: ADDRESS 2; Address3: ADDRESS 3; Address4: ADDRESS 4; Revision: -; SheetNumber: 4; SheetTotal: 4; ENG_APP_DATE: --/--/--; DSN_APP_DATE: --/--/--; CHK_APP_DATE: --/--/--
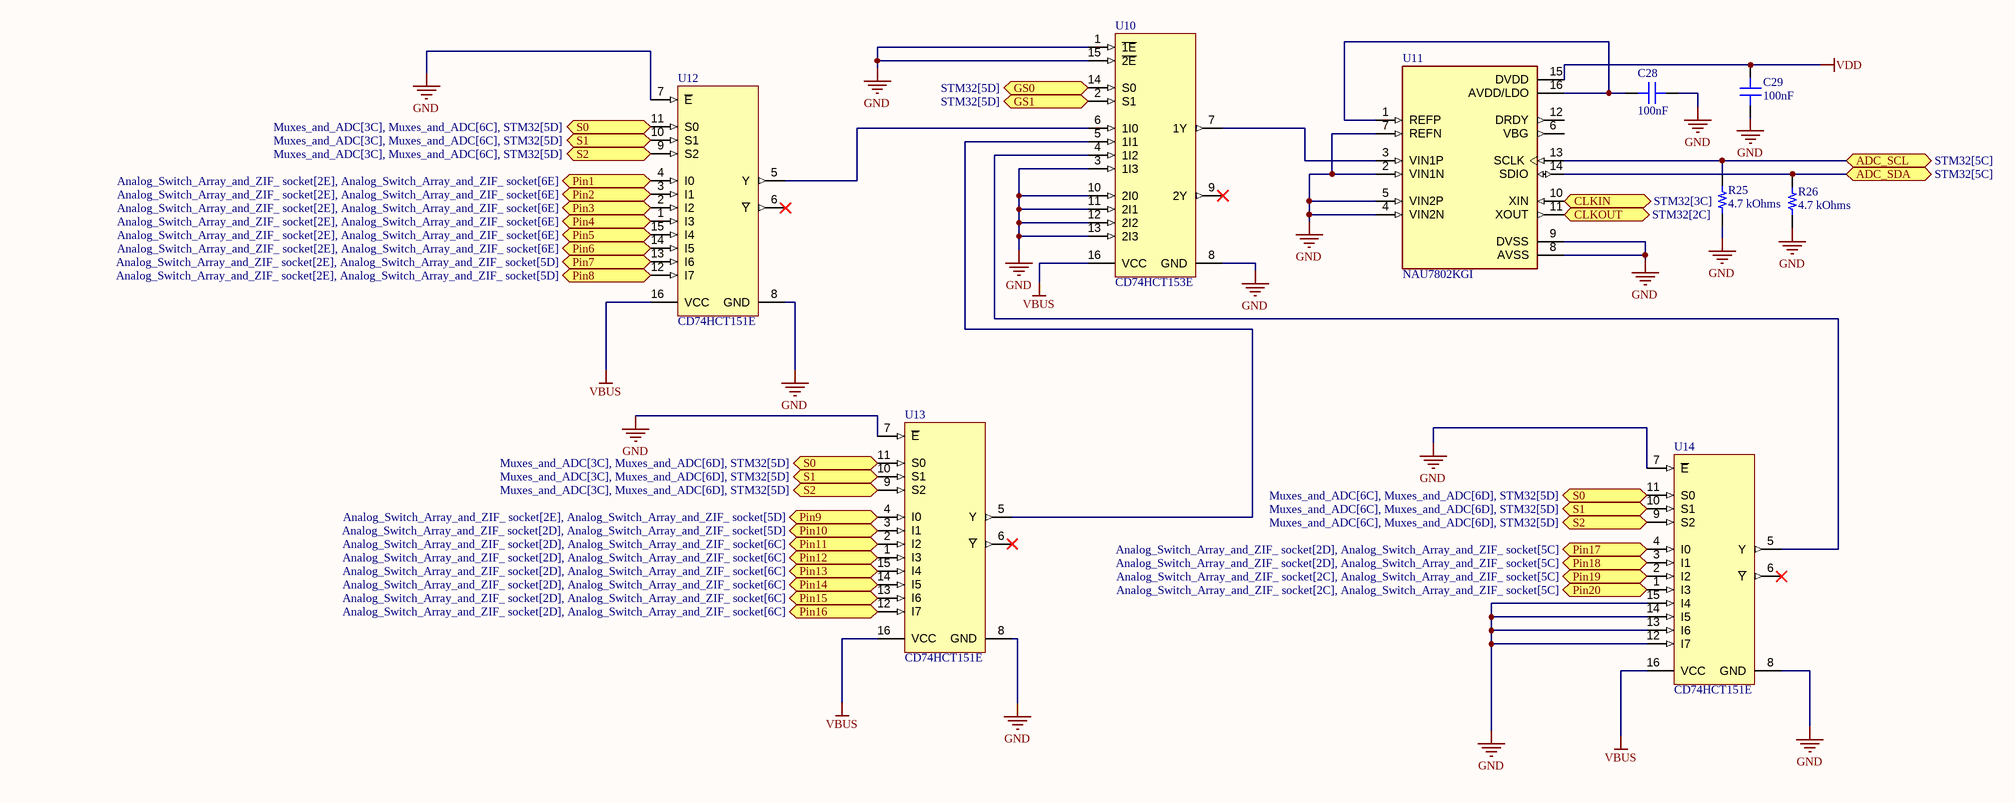
[diagram p3: Muxes_and_ADC.SchDoc]

### Parts
C28  value 100nF  [CAP 1206_3216 - 0.8MM]  (hidden comment: C1206X104G4HAC7800)
C29  value 100nF  [CAP 1206_3216 - 0.8MM]  (hidden comment: C1206X104G4HAC7800)
R25  value 4.7 kOhms  [RES 0603_1608]  (hidden comment: KTR03EZPF4701)
R26  value 4.7 kOhms  [RES 0603_1608]  (hidden comment: KTR03EZPF4701)
U10  CD74HCT153E  [N0016A]
U11  NAU7802KGI  [DIP792W45P254L1904H533Q16]
U12  CD74HCT151E  [N0016A]
U13  CD74HCT151E  [N0016A]
U14  CD74HCT151E  [N0016A]

### Ports
ADC_SCL (bidir, see STM32[5C]), ADC_SDA (bidir, see STM32[5C]), CLKIN (bidir, see STM32[3C]), CLKOUT (bidir, see STM32[2C]), GS0 (bidir, see STM32[5D]), GS1 (bidir, see STM32[5D]), Pin1 (bidir, see Analog_Switch_Array_and_ZIF_ socket[2E], Analog_Switch_Array_and_ZIF_ socket[6E]), Pin2 (bidir, see Analog_Switch_Array_and_ZIF_ socket[2E], Analog_Switch_Array_and_ZIF_ socket[6E]), Pin3 (bidir, see Analog_Switch_Array_and_ZIF_ socket[2E], Analog_Switch_Array_and_ZIF_ socket[6E]), Pin4 (bidir, see Analog_Switch_Array_and_ZIF_ socket[2E], Analog_Switch_Array_and_ZIF_ socket[6E]), Pin5 (bidir, see Analog_Switch_Array_and_ZIF_ socket[2E], Analog_Switch_Array_and_ZIF_ socket[6E]), Pin6 (bidir, see Analog_Switch_Array_and_ZIF_ socket[2E], Analog_Switch_Array_and_ZIF_ socket[6E]), Pin7 (bidir, see Analog_Switch_Array_and_ZIF_ socket[2E], Analog_Switch_Array_and_ZIF_ socket[5D]), Pin8 (bidir, see Analog_Switch_Array_and_ZIF_ socket[2E], Analog_Switch_Array_and_ZIF_ socket[5D]), Pin9 (bidir, see Analog_Switch_Array_and_ZIF_ socket[2E], Analog_Switch_Array_and_ZIF_ socket[5D]), Pin10 (bidir, see Analog_Switch_Array_and_ZIF_ socket[2D], Analog_Switch_Array_and_ZIF_ socket[5D]), Pin11 (bidir, see Analog_Switch_Array_and_ZIF_ socket[2D], Analog_Switch_Array_and_ZIF_ socket[6C]), Pin12 (bidir, see Analog_Switch_Array_and_ZIF_ socket[2D], Analog_Switch_Array_and_ZIF_ socket[6C]), Pin13 (bidir, see Analog_Switch_Array_and_ZIF_ socket[2D], Analog_Switch_Array_and_ZIF_ socket[6C]), Pin14 (bidir, see Analog_Switch_Array_and_ZIF_ socket[2D], Analog_Switch_Array_and_ZIF_ socket[6C]), Pin15 (bidir, see Analog_Switch_Array_and_ZIF_ socket[2D], Analog_Switch_Array_and_ZIF_ socket[6C]), Pin16 (bidir, see Analog_Switch_Array_and_ZIF_ socket[2D], Analog_Switch_Array_and_ZIF_ socket[6C]), Pin17 (bidir, see Analog_Switch_Array_and_ZIF_ socket[2D], Analog_Switch_Array_and_ZIF_ socket[5C]), Pin18 (bidir, see Analog_Switch_Array_and_ZIF_ socket[2D], Analog_Switch_Array_and_ZIF_ socket[5C]), Pin19 (bidir, see Analog_Switch_Array_and_ZIF_ socket[2C], Analog_Switch_Array_and_ZIF_ socket[5C]), Pin20 (bidir, see Analog_Switch_Array_and_ZIF_ socket[2C], Analog_Switch_Array_and_ZIF_ socket[5C]), S0 (bidir, see Muxes_and_ADC[3C], Muxes_and_ADC[6C], STM32[5D]), S0 (bidir, see Muxes_and_ADC[3C], Muxes_and_ADC[6D], STM32[5D]), S0 (bidir, see Muxes_and_ADC[6C], Muxes_and_ADC[6D], STM32[5D]), S1 (bidir, see Muxes_and_ADC[3C], Muxes_and_ADC[6C], STM32[5D]), S1 (bidir, see Muxes_and_ADC[3C], Muxes_and_ADC[6D], STM32[5D]), S1 (bidir, see Muxes_and_ADC[6C], Muxes_and_ADC[6D], STM32[5D]), S2 (bidir, see Muxes_and_ADC[3C], Muxes_and_ADC[6C], STM32[5D]), S2 (bidir, see Muxes_and_ADC[3C], Muxes_and_ADC[6D], STM32[5D]), S2 (bidir, see Muxes_and_ADC[6C], Muxes_and_ADC[6D], STM32[5D])

### Nets
GND: C28.1 C29.2 R25.1 R26.1 U10.1(~{1E}) U10.3(1I3) U10.8(GND) U10.10(2I0) U10.11(2I1) U10.12(2I2) U10.13(2I3) U10.15(~{2E}) U11.2(VIN1N) U11.4(VIN2N) U11.5(VIN2P) U11.7(REFN) U11.8(AVSS) U11.9(DVSS) U12.7(~{E}) U12.8(GND) U13.7(~{E}) U13.8(GND) U14.7(~{E}) U14.8(GND) U14.12(I7) U14.13(I6) U14.14(I5) U14.15(I4)
VBUS: U10.16(VCC) U12.16(VCC) U13.16(VCC) U14.16(VCC)
VDD: C29.1 U11.15(DVDD)
NetC11_2: U11.11(XOUT) ; port CLKOUT
NetC12_2: U11.10(XIN) ; port CLKIN
NetC28_2: C28.2 U11.1(REFP) U11.16(AVDD/LDO)
NetJ3_1: U12.4(I0) ; port Pin1
NetJ3_2: U12.3(I1) ; port Pin2
NetJ3_3: U12.2(I2) ; port Pin3
NetJ3_4: U12.1(I3) ; port Pin4
NetJ3_5: U12.15(I4) ; port Pin5
NetJ3_6: U12.14(I5) ; port Pin6
NetJ3_7: U12.13(I6) ; port Pin7
NetJ3_8: U12.12(I7) ; port Pin8
NetJ3_9: U13.4(I0) ; port Pin9
NetJ3_10: U13.3(I1) ; port Pin10
NetJ3_11: U13.2(I2) ; port Pin11
NetJ3_12: U13.1(I3) ; port Pin12
NetJ3_13: U13.15(I4) ; port Pin13
NetJ3_14: U13.14(I5) ; port Pin14
NetJ3_15: U13.13(I6) ; port Pin15
NetJ3_16: U13.12(I7) ; port Pin16
NetJ3_17: U14.4(I0) ; port Pin17
NetJ3_18: U14.3(I1) ; port Pin18
NetJ3_19: U14.2(I2) ; port Pin19
NetJ3_20: U14.1(I3) ; port Pin20
NetR25_2: R25.2 U11.13(SCLK) ; port ADC_SCL
NetR26_2: R26.2 U11.14(SDIO) ; port ADC_SDA
NetU7_18: U12.11(S0) U13.11(S0) U14.11(S0) ; port S0
NetU7_19: U12.10(S1) U13.10(S1) U14.10(S1) ; port S1
NetU7_20: U12.9(S2) U13.9(S2) U14.9(S2) ; port S2
NetU7_22: U10.2(S1) ; port GS1
NetU10_4: U10.4(1I2) U14.5(Y)
NetU10_5: U10.5(1I1) U13.5(Y)
NetU10_6: U10.6(1I0) U12.5(Y)
NetU10_7: U10.7(1Y) U11.3(VIN1P)
NetU10_14: U10.14(S0) ; port GS0

Not connected (* = marked no-connect by the designer): U10 9(2Y)*; U11 6(VBG) 12(DRDY); U12 6(~{Y})*; U13 6(~{Y})*; U14 6(~{Y})*

### Notes on the sheet
- DWG. NO.
- REV.
- SHT.
- THIS DOCUMENT AND THE DATA DISCLOSED HEREIN OR HEREWITH IS THE PROPERTY OF ALTIUM LIMITED AND MAY BE FREELY DISTRIBUTED IN WHOLE. NO RIGHTS ARE RESERVED OR EXPRESS OR IMPLIED WARANTEE GIVEN.
- REVISION
- DESCRIPTION
- DATE
- APPROVED
- ENG:
- APPROVALS
- PROJECT
- DSN:
- CHK:
- REFERENCE DOCUMENTS
- PROJECT REVISION:
- TITLE
- DOCUMENT REVISION:
- DESIGN ITEM:
- BOM:
- FAB DWG:
- PCB DWG:
- ASSY DWG:
- SCALE:
- SIZE
- B
- CAGE CODE
- FILE NAME
- DWG NO.
- SHEET
- OF
- REV

### Library data of the parts
C28 C29 = CMP-001-063573-1: CAP CER 1206 0.1F 16V ULTRA STAB; Part Number: C1206X104G4HAC7800
R25 R26 = CMP-009-042855-1: RES SMD 4.7K OHM 1% 1/10W 0603; Part Number: KTR03EZPF4701
U10 = CMP-1633-00665-2: High Speed CMOS Logic Dual 4-Input Multiplexers, N0016A, TUBE; Manufacturer: Texas Instruments; VCC(Max)(V): 5.5; Voltage(Nom)(V): 5; ICC @ Nom Voltage(Max)(mA): 0.08; Configuration: 4：1; Rating: Catalog; tpd @ Nom Voltage(Max)(ns): 43; F @ Nom Voltage(Max)(Mhz): 25; VCC(Min)(V): 4.5; Function: Encoder/Multiplexer; Technology Family: HCT; Schmitt Trigger: No; Bits(#): 4; Input Type: TTL; Channels(#): 2; Output Drive (IOL/IOH)(Max)(mA): 4/-4; Output Type: CMOS; Operating Temperature Range(C): -55 to 125; Type: Standard; Code_JEDEC: MS-001; Generic Part Number: CD74HCT153; PackageReference: N0016A; DatasheetVersion: SCHS151C
U11 = CMP-00254-1: 24 Bit Analog to Digital Converter 2 Input 1 Sigma-Delta 16-PDIP; MF: Nuvoton Technology Corporation of America; Source: NAU7802KGI.SchLib; SnapEDA_Link: https://www.snapeda.com/parts/NAU7802KGI/Nuvoton/view-part/?ref=snap; Check_prices: https://www.snapeda.com/parts/NAU7802KGI/Nuvoton/view-part/?ref=eda; Pin Count: 16; Package: Package; Component Type: Standard; Value: *; Design Item ID: NAU7802KGI; MP: NAU7802KGI
U12-U14 = CMP-1633-00678-2: High Speed CMOS Logic 8-Input Multiplexer, N0016A, TUBE; Manufacturer: Texas Instruments; Output Drive (IOL/IOH)(Max)(mA): 4/-4; Technology Family: HCT; Input Type: TTL; F @ Nom Voltage(Max)(Mhz): 25; Rating: Catalog; Bits(#): 8; VCC(Min)(V): 4.5; VCC(Max)(V): 5.5; Schmitt Trigger: No; tpd @ Nom Voltage(Max)(ns): 48; ICC @ Nom Voltage(Max)(mA): 0.08; Channels(#): 1; Function: Encoder/Multiplexer; Configuration: 8：1; Voltage(Nom)(V): 5; Generic Part Number: CD74HCT151; PackageReference: N0016A; Output Type: CMOS; Code_JEDEC: MS-001; DatasheetVersion: SCHS150C; Type: Standard; Operating Temperature Range(C): -55 to 125

## Nets that join several sheets
GND: USB_to_UART (18 pins), Analog_Switch_Array_and_ZIF_ socket (27 pins), Muxes_and_ADC (28 pins)
VBUS: USB_to_UART (9 pins), Muxes_and_ADC (U10.16 U12.16 U13.16 U14.16)
VDD: USB_to_UART (C1.1 C2.1 D7.2 U1.6), STM32 (C14.2 C15.2 J2.1 U7.8), Analog_Switch_Array_and_ZIF_ socket (11 pins), Muxes_and_ADC (C29.1 U11.15)
NetC6_2: STM32 (C6.2 R1.2 R7.2 U2.3), Analog_Switch_Array_and_ZIF_ socket (U8.10 U9.10)
NetC7_2: STM32 (C7.2 R4.2 R8.2 U4.3), Analog_Switch_Array_and_ZIF_ socket (U8.11 U9.11)
NetC8_2: STM32 (C8.2 R5.2 R9.2 U3.3), Analog_Switch_Array_and_ZIF_ socket (U8.12 U9.12)
NetC9_2: STM32 (C9.2 R6.2 R10.2 U5.3), Analog_Switch_Array_and_ZIF_ socket (U8.13 U9.13)
NetC10_2: STM32 (C10.2 R11.2 R16.2 U6.3), Analog_Switch_Array_and_ZIF_ socket (U8.9 U9.9)
NetC11_2: STM32 (C11.2 U7.11 Y1.3), Muxes_and_ADC (U11.11)
NetC12_2: STM32 (C12.2 U7.10 Y1.1), Muxes_and_ADC (U11.10)
NetD4_2: USB_to_UART (D4.2 U1.25), STM32 (U7.37)
NetD5_2: USB_to_UART (D5.2 U1.26), STM32 (U7.42)
NetJ3_1: Analog_Switch_Array_and_ZIF_ socket (J3.1 U8.3), Muxes_and_ADC (U12.4)
NetJ3_2: Analog_Switch_Array_and_ZIF_ socket (J3.2 U8.4), Muxes_and_ADC (U12.3)
NetJ3_3: Analog_Switch_Array_and_ZIF_ socket (J3.3 U8.5), Muxes_and_ADC (U12.2)
NetJ3_4: Analog_Switch_Array_and_ZIF_ socket (J3.4 U8.6), Muxes_and_ADC (U12.1)
NetJ3_5: Analog_Switch_Array_and_ZIF_ socket (J3.5 U8.7), Muxes_and_ADC (U12.15)
NetJ3_6: Analog_Switch_Array_and_ZIF_ socket (J3.6 U8.8), Muxes_and_ADC (U12.14)
NetJ3_7: Analog_Switch_Array_and_ZIF_ socket (J3.7 U8.17), Muxes_and_ADC (U12.13)
NetJ3_8: Analog_Switch_Array_and_ZIF_ socket (J3.8 U8.18), Muxes_and_ADC (U12.12)
NetJ3_9: Analog_Switch_Array_and_ZIF_ socket (J3.9 U8.19), Muxes_and_ADC (U13.4)
NetJ3_10: Analog_Switch_Array_and_ZIF_ socket (J3.10 U8.20), Muxes_and_ADC (U13.3)
NetJ3_11: Analog_Switch_Array_and_ZIF_ socket (J3.11 U9.3), Muxes_and_ADC (U13.2)
NetJ3_12: Analog_Switch_Array_and_ZIF_ socket (J3.12 U9.4), Muxes_and_ADC (U13.1)
NetJ3_13: Analog_Switch_Array_and_ZIF_ socket (J3.13 U9.5), Muxes_and_ADC (U13.15)
NetJ3_14: Analog_Switch_Array_and_ZIF_ socket (J3.14 U9.6), Muxes_and_ADC (U13.14)
NetJ3_15: Analog_Switch_Array_and_ZIF_ socket (J3.15 U9.7), Muxes_and_ADC (U13.13)
NetJ3_16: Analog_Switch_Array_and_ZIF_ socket (J3.16 U9.8), Muxes_and_ADC (U13.12)
NetJ3_17: Analog_Switch_Array_and_ZIF_ socket (J3.17 U9.17), Muxes_and_ADC (U14.4)
NetJ3_18: Analog_Switch_Array_and_ZIF_ socket (J3.18 U9.18), Muxes_and_ADC (U14.3)
NetJ3_19: Analog_Switch_Array_and_ZIF_ socket (J3.19 U9.19), Muxes_and_ADC (U14.2)
NetJ3_20: Analog_Switch_Array_and_ZIF_ socket (J3.20 U9.20), Muxes_and_ADC (U14.1)
NetR20_1: STM32 (U7.60), Analog_Switch_Array_and_ZIF_ socket (R20.1 R23.1 U8.27 U9.27)
NetR20_2: STM32 (U7.61), Analog_Switch_Array_and_ZIF_ socket (6 pins)
NetR25_2: STM32 (U7.30), Muxes_and_ADC (R25.2 U11.13)
NetR26_2: STM32 (U7.31), Muxes_and_ADC (R26.2 U11.14)
NetU7_18: STM32 (U7.18), Muxes_and_ADC (U12.11 U13.11 U14.11)
NetU7_19: STM32 (U7.19), Muxes_and_ADC (U12.10 U13.10 U14.10)
NetU7_20: STM32 (U7.20), Muxes_and_ADC (U12.9 U13.9 U14.9)
NetU7_22: STM32 (U7.22), Muxes_and_ADC (U10.2)